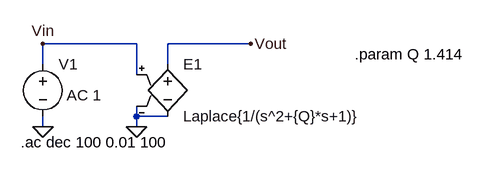
[diagram p0: schematic laplace.asc]
laplace.asc, the LTspice schematic file:
Version 4
SHEET 1 880 680
WIRE 96 112 -48 112
WIRE 272 112 144 112
WIRE -48 144 -48 112
WIRE 144 144 144 112
WIRE 96 160 96 112
WIRE 96 224 96 208
WIRE 144 224 96 224
WIRE -48 240 -48 224
WIRE 96 240 96 224
FLAG -48 240 0
FLAG 96 240 0
FLAG 272 112 Vout
FLAG -48 112 Vin
SYMBOL e 144 128 R0
SYMATTR InstName E1
SYMATTR Value Laplace{1/(s^2+{Q}*s+1)}
SYMBOL voltage -48 128 R0
WINDOW 123 37 63 Left 2
WINDOW 39 0 0 Left 0
SYMATTR InstName V1
SYMATTR Value ""
SYMATTR Value2 AC 1
TEXT -82 264 Left 2 !.ac dec 100 0.01 100
TEXT 432 128 Left 2 !.param Q 1.414

The netlist it stands for:
* laplace.asc
E1 Vout 0 Vin 0 Laplace{1/(s^2+{Q}*s+1)}
V1 Vin 0 AC 1
.ac dec 100 0.01 100
.param Q 1.414
.backanno
.end